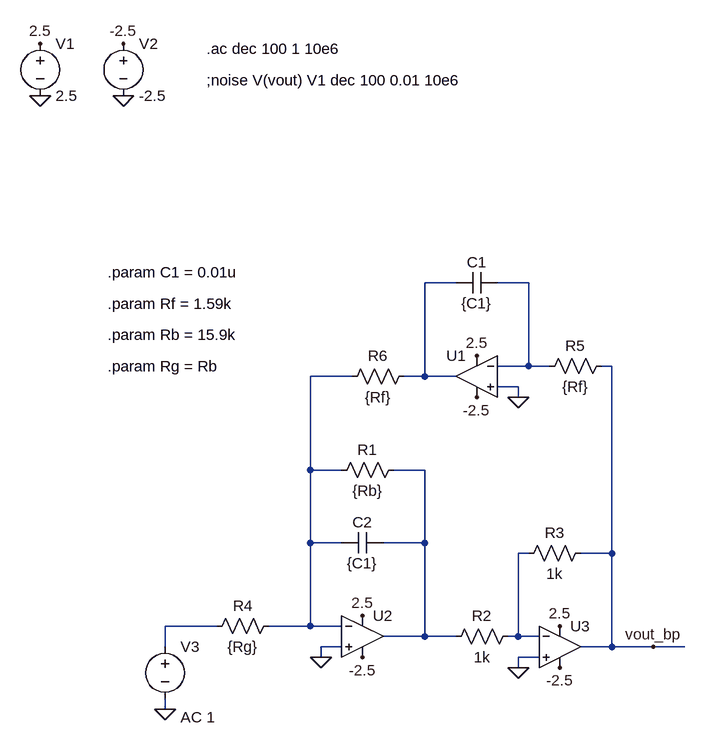
[diagram p0: schematic biquad_bandpass.asc]
biquad_bandpass.asc, the LTspice schematic file:
Version 4
SHEET 1 880 1132
WIRE 432 448 384 448
WIRE 544 448 496 448
WIRE 544 576 544 448
WIRE 544 576 496 576
WIRE 576 576 544 576
WIRE 672 576 656 576
WIRE 272 592 208 592
WIRE 384 592 384 448
WIRE 384 592 352 592
WIRE 432 592 384 592
WIRE 528 608 496 608
WIRE 528 624 528 608
WIRE 208 736 208 592
WIRE 256 736 208 736
WIRE 384 736 336 736
WIRE 208 848 208 736
WIRE 256 848 208 848
WIRE 384 848 384 736
WIRE 384 848 320 848
WIRE 544 864 528 864
WIRE 672 864 672 576
WIRE 672 864 624 864
WIRE 64 976 -16 976
WIRE 208 976 208 848
WIRE 208 976 144 976
WIRE 256 976 208 976
WIRE 384 992 384 848
WIRE 384 992 320 992
WIRE 432 992 384 992
WIRE 528 992 528 864
WIRE 528 992 512 992
WIRE 560 992 528 992
WIRE -16 1008 -16 976
WIRE 256 1008 224 1008
WIRE 672 1008 672 864
WIRE 672 1008 624 1008
WIRE 736 1008 672 1008
WIRE 784 1008 736 1008
WIRE 224 1024 224 1008
WIRE 560 1024 528 1024
WIRE 528 1040 528 1024
WIRE -16 1104 -16 1088
FLAG -208 80 2.5
FLAG -80 80 -2.5
FLAG -208 160 0
FLAG -80 160 0
FLAG 592 976 2.5
FLAG 592 1040 -2.5
FLAG 288 960 2.5
FLAG 288 1024 -2.5
FLAG 464 560 2.5
FLAG 464 624 -2.5
FLAG 528 1040 0
FLAG 528 624 0
FLAG 224 1024 0
FLAG -16 1104 0
FLAG 736 1008 vout_bp
SYMBOL voltage -208 64 R0
WINDOW 123 0 0 Left 0
WINDOW 39 0 0 Left 0
SYMATTR InstName V1
SYMATTR Value 2.5
SYMBOL voltage -80 64 R0
WINDOW 123 0 0 Left 0
WINDOW 39 0 0 Left 0
SYMATTR InstName V2
SYMATTR Value -2.5
SYMBOL Opamps\\UniversalOpamp2 464 592 M0
SYMATTR InstName U1
SYMATTR Value2 Avol=1Meg GBW=1Meg Slew=10Meg
SYMBOL Opamps\\UniversalOpamp2 288 992 R0
SYMATTR InstName U2
SYMATTR Value2 Avol=1Meg GBW=1Meg Slew=10Meg
SYMBOL Opamps\\UniversalOpamp2 592 1008 R0
SYMATTR InstName U3
SYMATTR Value2 Avol=1Meg GBW=1Meg Slew=10Meg
SYMBOL cap 496 432 R90
WINDOW 0 0 32 VBottom 2
WINDOW 3 32 32 VTop 2
SYMATTR InstName C1
SYMATTR Value {C1}
SYMBOL cap 320 832 R90
WINDOW 0 0 32 VBottom 2
WINDOW 3 32 32 VTop 2
SYMATTR InstName C2
SYMATTR Value {C1}
SYMBOL res 352 720 R90
WINDOW 0 0 56 VBottom 2
WINDOW 3 32 56 VTop 2
SYMATTR InstName R1
SYMATTR Value {Rb}
SYMBOL res 528 976 R90
WINDOW 0 0 56 VBottom 2
WINDOW 3 32 56 VTop 2
SYMATTR InstName R2
SYMATTR Value 1k
SYMBOL res 640 848 R90
WINDOW 0 0 56 VBottom 2
WINDOW 3 32 56 VTop 2
SYMATTR InstName R3
SYMATTR Value 1k
SYMBOL res 160 960 R90
WINDOW 0 0 56 VBottom 2
WINDOW 3 32 56 VTop 2
SYMATTR InstName R4
SYMATTR Value {Rg}
SYMBOL res 672 560 R90
WINDOW 0 0 56 VBottom 2
WINDOW 3 32 56 VTop 2
SYMATTR InstName R5
SYMATTR Value {Rf}
SYMBOL res 368 576 R90
WINDOW 0 0 56 VBottom 2
WINDOW 3 32 56 VTop 2
SYMATTR InstName R6
SYMATTR Value {Rf}
SYMBOL voltage -16 992 R0
WINDOW 123 24 124 Left 2
WINDOW 39 0 0 Left 0
SYMATTR InstName V3
SYMATTR Value ""
SYMATTR Value2 AC 1
TEXT 48 88 Left 2 !.ac dec 100 1 10e6
TEXT 48 136 Left 2 !;noise V(vout) V1 dec 100 0.01 10e6
TEXT -104 432 Left 2 !.param C1 = 0.01u
TEXT -104 480 Left 2 !.param Rf = 1.59k
TEXT -104 528 Left 2 !.param Rb = 15.9k
TEXT -104 576 Left 2 !.param Rg = Rb

The netlist it stands for:
* biquad_bandpass.asc
V1 2.5 0 2.5
V2 -2.5 0 -2.5
XU1 0 N002 2.5 -2.5 N001 level.2 Avol=1Meg GBW=1Meg Slew=10Meg ilimit=25m rail=0 Vos=0 phimargin=45 en=0 enk=0 in=0 ink=0 Rin=500Meg  ; pins IN+ IN- V+ V- OUT
XU2 0 N003 2.5 -2.5 N004 level.2 Avol=1Meg GBW=1Meg Slew=10Meg ilimit=25m rail=0 Vos=0 phimargin=45 en=0 enk=0 in=0 ink=0 Rin=500Meg  ; pins IN+ IN- V+ V- OUT
XU3 0 N005 2.5 -2.5 vout_bp level.2 Avol=1Meg GBW=1Meg Slew=10Meg ilimit=25m rail=0 Vos=0 phimargin=45 en=0 enk=0 in=0 ink=0 Rin=500Meg  ; pins IN+ IN- V+ V- OUT
C1 N002 N001 {C1}
C2 N004 N003 {C1}
R1 N004 N003 {Rb}
R2 N005 N004 1k
R3 vout_bp N005 1k
R4 N003 N006 {Rg}
R5 vout_bp N002 {Rf}
R6 N001 N003 {Rf}
V3 N006 0 AC 1
.ac dec 100 1 10e6
;noise V(vout) V1 dec 100 0.01 10e6
.param C1 = 0.01u
.param Rf = 1.59k
.param Rb = 15.9k
.param Rg = Rb
.lib UniversalOpamps2.sub
.backanno
.end